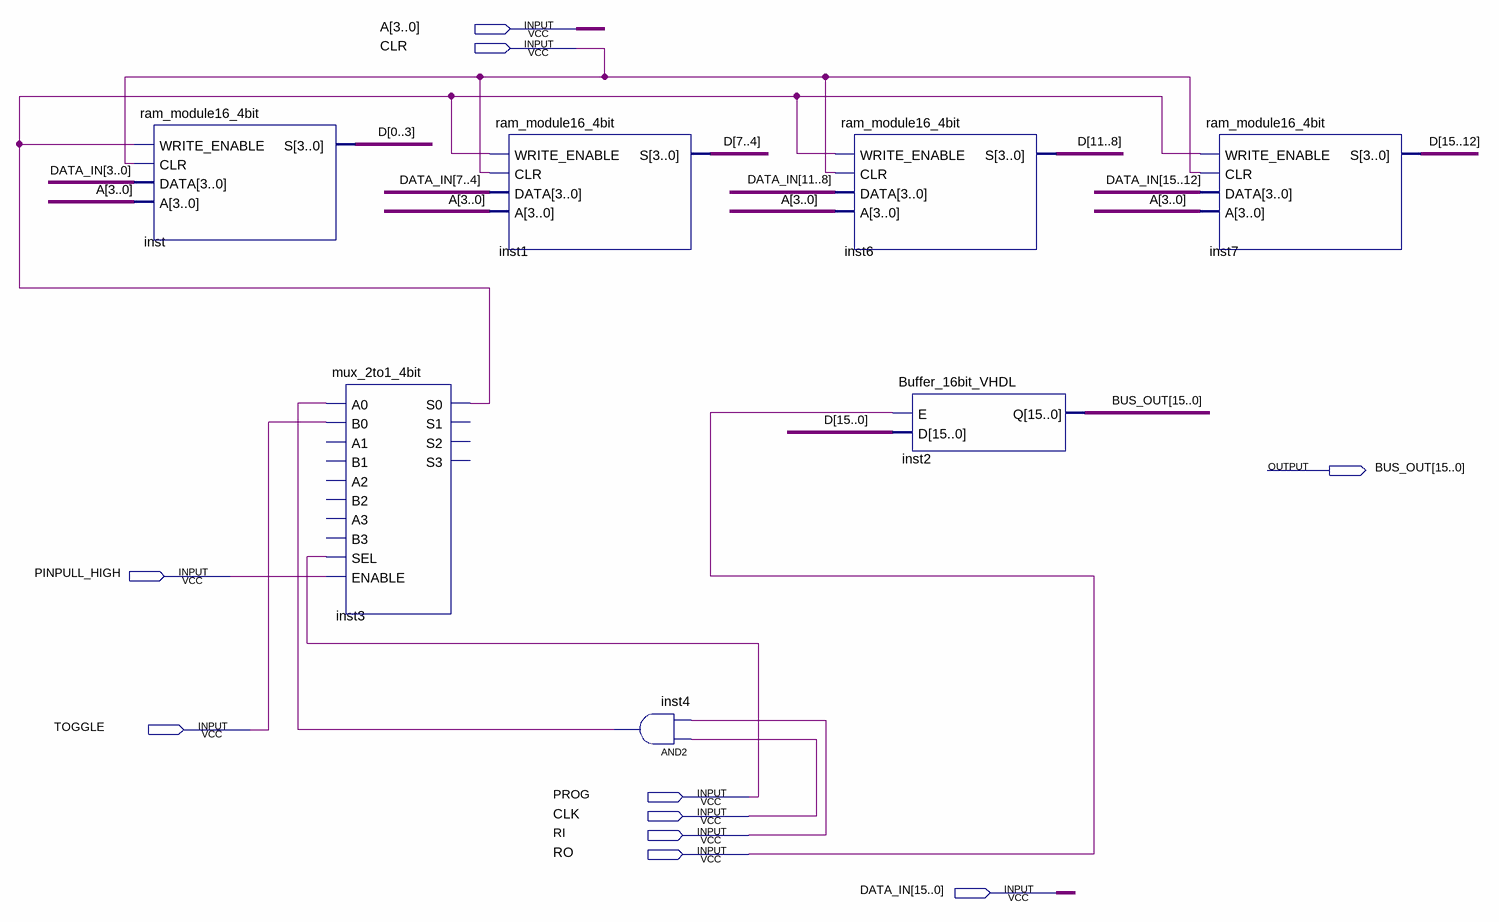
[diagram p0: schematic sheet]
// Quartus schematic ram_16bit.bdf as structural Verilog: 7 symbols, 10 pins
module ram_16bit (
  input  [3:0] A,
  input  CLR,
  input  PINPULL_HIGH,
  input  TOGGLE,
  input  PROG,
  input  CLK,
  input  RI,
  input  RO,
  input  [15:0] DATA_IN,
  output [15:0] BUS_OUT
);

  wire inst3_s0, inst4_out;
  wire [15:0] D;

  ram_module16_4bit inst (.WRITE_ENABLE(inst3_s0), .CLR(CLR), .DATA(DATA_IN[3:0]), .A(A), .S({D[0], D[1], D[2], D[3]}));
  mux_2to1_4bit inst3 (
    .A0(inst4_out), .B0(TOGGLE), .SEL(PROG), .ENABLE(PINPULL_HIGH), .S0(inst3_s0));  // open: A1, B1, A2, B2, A3, B3, S1, S2, S3
  ram_module16_4bit inst1 (.WRITE_ENABLE(inst3_s0), .CLR(CLR), .DATA(DATA_IN[7:4]), .A(A), .S(D[7:4]));
  and inst4 (inst4_out, CLK, RI);
  ram_module16_4bit inst6 (.WRITE_ENABLE(inst3_s0), .CLR(CLR), .DATA(DATA_IN[11:8]), .A(A), .S(D[11:8]));
  Buffer_16bit_VHDL inst2 (.E(RO), .D(D), .Q(BUS_OUT));
  ram_module16_4bit inst7 (.WRITE_ENABLE(inst3_s0), .CLR(CLR), .DATA(DATA_IN[15:12]), .A(A), .S(D[15:12]));
endmodule
